# EAGLE design DIGITAL2 (EAGLE 6.5.0)
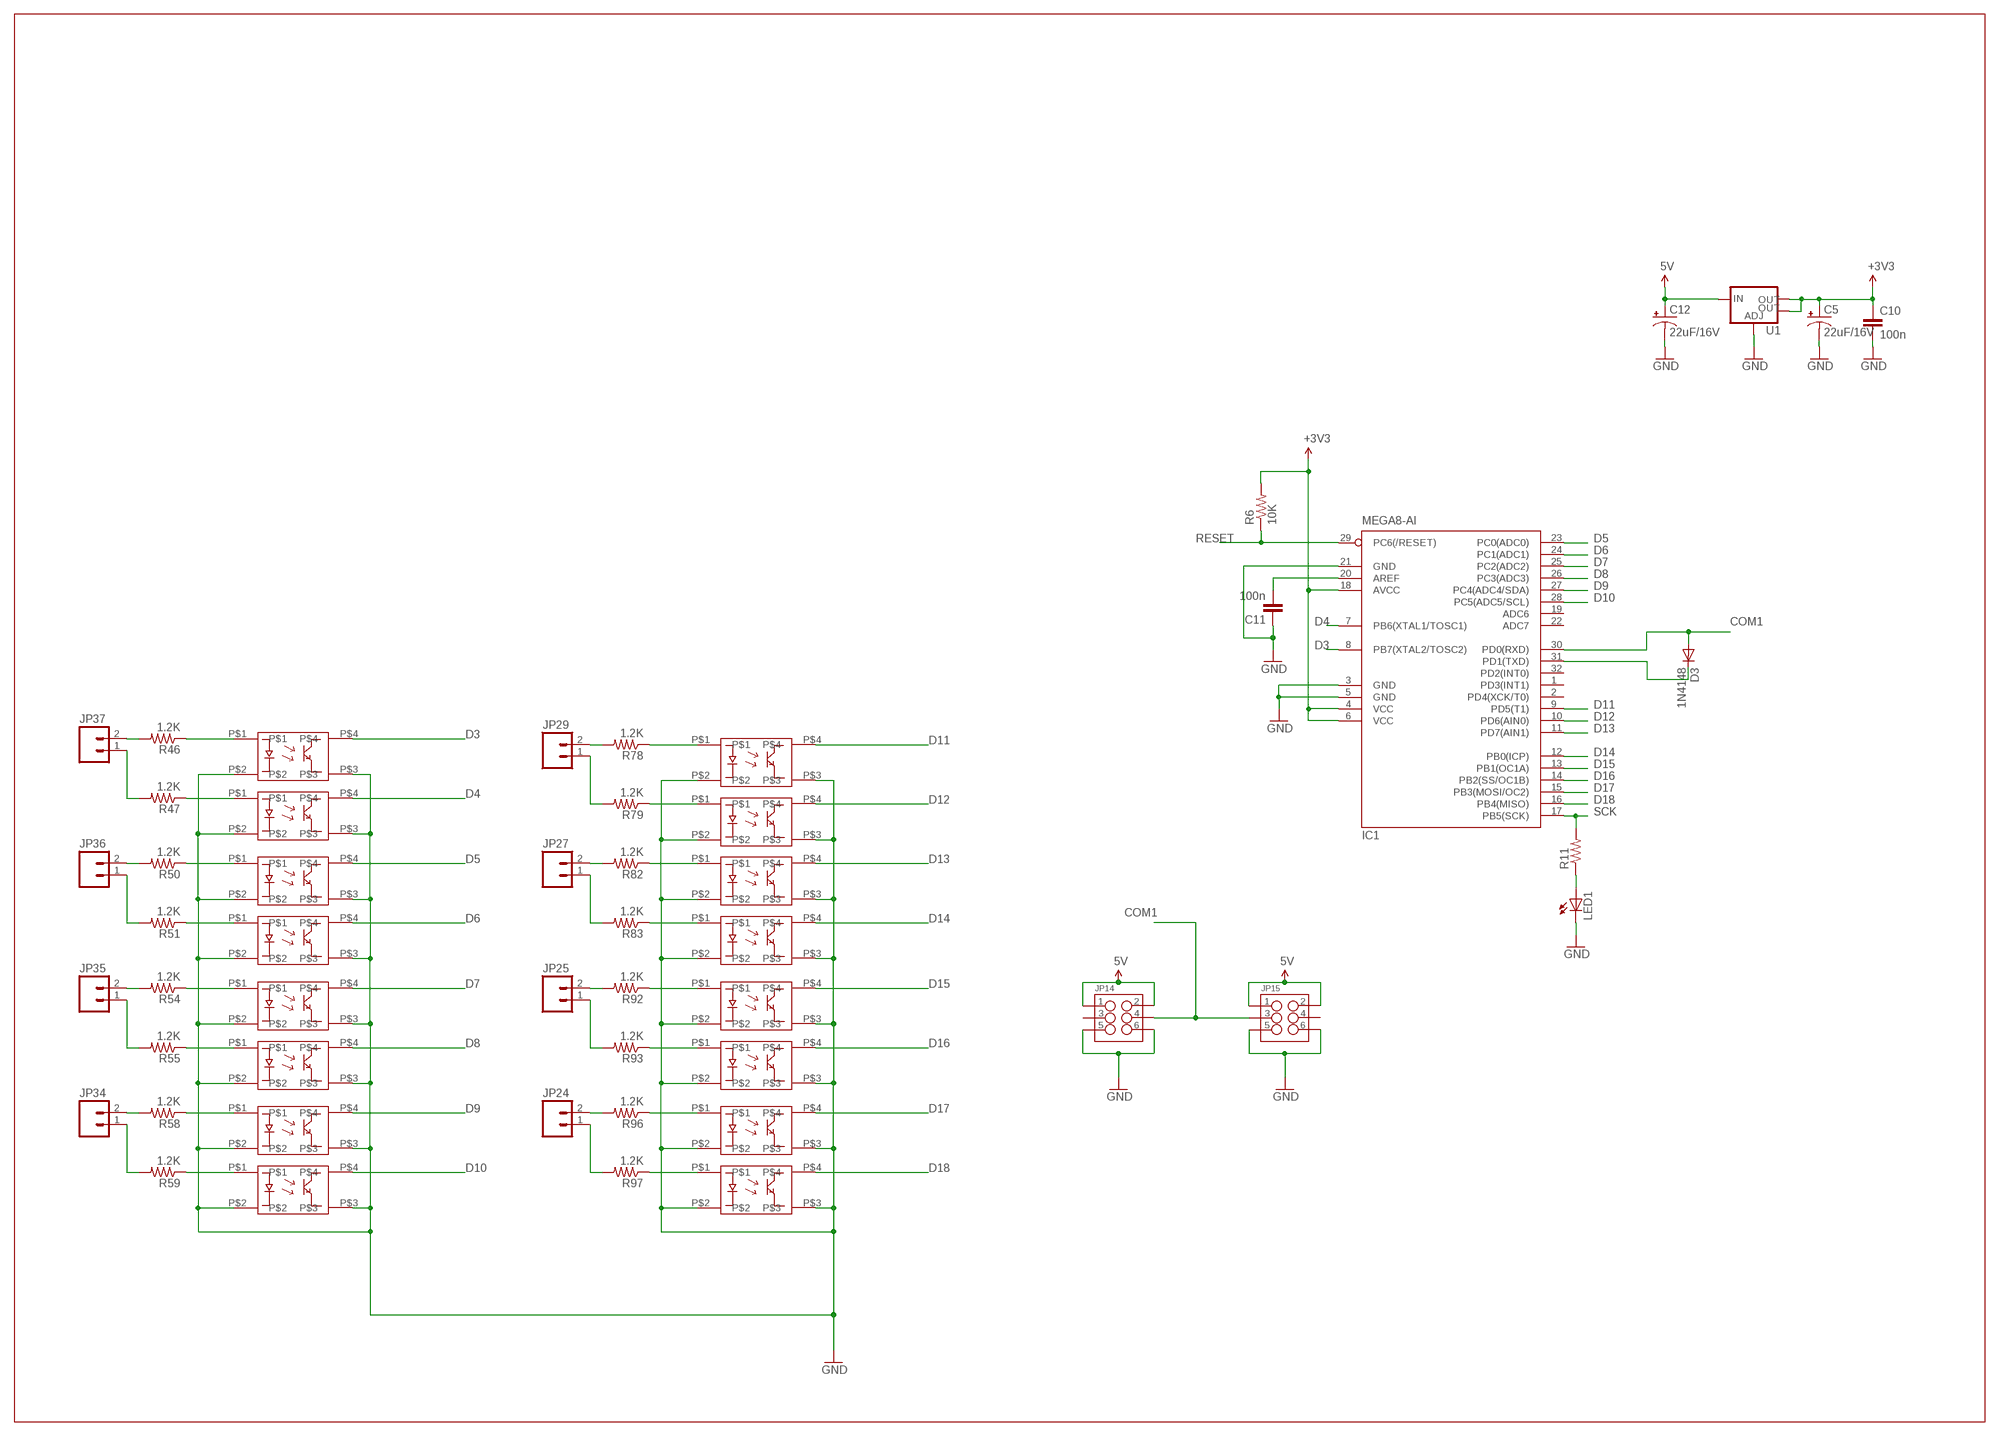
[diagram p0: schematic, sheet 1]

## Parts
C5  22uF/16V  CAP_POL1206  [EIA3216]
C10  100n  CAP0805  [0805]
C11  100n  CAP0805  [0805]
C12  22uF/16V  CAP_POL1206  [EIA3216]
D3  1N4148  DIODE-MINIMELF  [MINIMELF]
IC1  MEGA8-AI  [TQFP32-08]
JP14  M03X22X3_SILK_MALE_PTH  [2X3]
JP15  M03X22X3_SILK_MALE_PTH  [2X3]
JP24  M025MM  [SCREWTERMINAL-5MM-2]
JP25  M025MM  [SCREWTERMINAL-5MM-2]
JP27  M025MM  [SCREWTERMINAL-5MM-2]
JP29  M025MM  [SCREWTERMINAL-5MM-2]
JP34  M025MM  [SCREWTERMINAL-5MM-2]
JP35  M025MM  [SCREWTERMINAL-5MM-2]
JP36  M025MM  [SCREWTERMINAL-5MM-2]
JP37  M025MM  [SCREWTERMINAL-5MM-2]
LED1  LEDCHIP-LED0805  [CHIP-LED0805]
R6  10K  RESISTOR0805-RES  [0805]
R11  RESISTOR0805-RES  [0805]
R46  1.2K  RESISTOR1206  [1206]
R47  1.2K  RESISTOR1206  [1206]
R50  1.2K  RESISTOR1206  [1206]
R51  1.2K  RESISTOR1206  [1206]
R54  1.2K  RESISTOR1206  [1206]
R55  1.2K  RESISTOR1206  [1206]
R58  1.2K  RESISTOR1206  [1206]
R59  1.2K  RESISTOR1206  [1206]
R78  1.2K  RESISTOR1206  [1206]
R79  1.2K  RESISTOR1206  [1206]
R82  1.2K  RESISTOR1206  [1206]
R83  1.2K  RESISTOR1206  [1206]
R92  1.2K  RESISTOR1206  [1206]
R93  1.2K  RESISTOR1206  [1206]
R96  1.2K  RESISTOR1206  [1206]
R97  1.2K  RESISTOR1206  [1206]
U1  V_REG_LM1117SOT223  [SOT223]
U$13  IS181D-I  [TLP181-I]
U$14  IS181D-I  [TLP181-I]
U$15  IS181D-I  [TLP181-I]
U$16  IS181D-I  [TLP181-I]
U$17  IS181D-I  [TLP181-I]
U$18  IS181D-I  [TLP181-I]
U$19  IS181D-I  [TLP181-I]
U$20  IS181D-I  [TLP181-I]
U$29  IS181D-I  [TLP181-I]
U$30  IS181D-I  [TLP181-I]
U$31  IS181D-I  [TLP181-I]
U$32  IS181D-I  [TLP181-I]
U$33  IS181D-I  [TLP181-I]
U$34  IS181D-I  [TLP181-I]
U$35  IS181D-I  [TLP181-I]
U$36  IS181D-I  [TLP181-I]

## Nets
5V: C12.A(+) JP14.1 JP14.2 JP15.1 JP15.2 U1.3(IN)
COM1: D3.A IC1.30(PD0(RXD)) JP14.4 JP15.3
D3: IC1.8(PB7(XTAL2/TOSC2)) U$13.P$4
D4: IC1.7(PB6(XTAL1/TOSC1)) U$14.P$4
D5: IC1.23(PC0(ADC0)) U$15.P$4
D6: IC1.24(PC1(ADC1)) U$16.P$4
D7: IC1.25(PC2(ADC2)) U$17.P$4
D8: IC1.26(PC3(ADC3)) U$18.P$4
D9: IC1.27(PC4(ADC4/SDA)) U$19.P$4
D10: IC1.28(PC5(ADC5/SCL)) U$20.P$4
D11: IC1.9(PD5(T1)) U$29.P$4
D12: IC1.10(PD6(AIN0)) U$30.P$4
D13: IC1.11(PD7(AIN1)) U$31.P$4
D14: IC1.12(PB0(ICP)) U$32.P$4
D15: IC1.13(PB1(OC1A)) U$33.P$4
D16: IC1.14(PB2(SS/OC1B)) U$34.P$4
D17: IC1.15(PB3(MOSI/OC2)) U$35.P$4
D18: IC1.16(PB4(MISO)) U$36.P$4
GND: C5.C(-) C10.2 C11.1 C12.C(-) IC1.3(GND) IC1.5(GND) IC1.21(GND) JP14.5 JP14.6 JP15.5 JP15.6 LED1.C U1.1(ADJ) U$13.P$2 U$13.P$3 U$14.P$2 U$14.P$3 U$15.P$2 U$15.P$3 U$16.P$2 U$16.P$3 U$17.P$2 U$17.P$3 U$18.P$2 U$18.P$3 U$19.P$2 U$19.P$3 U$20.P$2 U$20.P$3 U$29.P$2 U$29.P$3 U$30.P$2 U$30.P$3 U$31.P$2 U$31.P$3 U$32.P$2 U$32.P$3 U$33.P$2 U$33.P$3 U$34.P$2 U$34.P$3 U$35.P$2 U$35.P$3 U$36.P$2 U$36.P$3
N$1: LED1.A R11.1
N$3: D3.C IC1.31(PD1(TXD))
N$4: JP29.2 R78.2
N$5: C11.2 IC1.20(AREF)
N$6: JP27.2 R82.2
N$7: JP25.2 R92.2
N$11: JP24.2 R96.2
N$20: JP27.1 R83.2
N$23: JP25.1 R93.2
N$28: JP24.1 R97.2
N$81: JP37.2 R46.2
N$82: JP37.1 R47.2
N$83: R46.1 U$13.P$1
N$84: R47.1 U$14.P$1
N$87: JP36.2 R50.2
N$88: JP36.1 R51.2
N$89: R50.1 U$15.P$1
N$90: R51.1 U$16.P$1
N$93: JP35.2 R54.2
N$94: JP35.1 R55.2
N$95: R54.1 U$17.P$1
N$96: R55.1 U$18.P$1
N$100: JP34.2 R58.2
N$101: JP34.1 R59.2
N$102: R58.1 U$19.P$1
N$103: R59.1 U$20.P$1
N$138: JP29.1 R79.2
N$139: R78.1 U$29.P$1
N$140: R79.1 U$30.P$1
N$146: R82.1 U$31.P$1
N$147: R83.1 U$32.P$1
N$154: R92.1 U$33.P$1
N$155: R93.1 U$34.P$1
N$160: R96.1 U$35.P$1
N$161: R97.1 U$36.P$1
RESET: IC1.29(PC6(/RESET)) R6.1
SCK: IC1.17(PB5(SCK)) R11.2
VCC: C5.A(+) C10.1 IC1.4(VCC) IC1.6(VCC) IC1.18(AVCC) R6.2 U1.2(OUT) U1.4(OUT) ; supply symbol labelled +3V3
Unconnected: IC1.1(PD3(INT1)) IC1.2(PD4(XCK/T0)) IC1.19(ADC6) IC1.22(ADC7) IC1.32(PD2(INT0)) JP14.3 JP15.4

## Library data of the parts
C5 C12 = SparkFun-Passives:CAP_POL: Capacitor Polarized These are standard SMD and PTH capacitors. Normally 10uF, 47uF, and 100uF in electrolytic and tantalum varieties. Always verify the external diameter of the through hole cap, it varies with capacity, voltage, and manufacturer. The EIA devices should be standard.
C10 C11 = SparkFun-Passives:CAP: Capacitor Standard 0603 ceramic capacitor, and 0.1" leaded capacitor.
D3 = diode:DIODE-: DIODE
IC1 = atmel:MEGA8: MICROCONTROLLER 8 Kbytes FLASH, 1 kbytes SRAM, 512 bytes EEPROM, USART, 6-channel 10 bit ADC, 2-channel 8 bit ADC Pin compatible with Atmega48, ATMega88, ATMega168 Source: avr.lbr; MPN: ATMEGA8-16AU; OC_FARNELL: 9171371; OC_NEWARK: 73M8863
JP14 JP15 = SparkFun-Connectors:M03X2: 2x3 .1" header. Shrouded, with keying- CONN-10681 SMT- CONN-11415 Pogo pins- HW-11044; PROD_ID: CONN-09701
JP24 JP25 JP27 JP29 JP34-JP37 = SparkFun-Connectors:M02: Header 2 Standard 2-pin 0.1" header. Use with straight break away headers (SKU : PRT-00116), right angle break away headers (PRT-00553), swiss pins (PRT-00743), machine pins (PRT-00117), and female headers (PRT-00115). Molex polarized connector foot print use with SKU : PRT-08233 with associated crimp pins and housings.
LED1 = led:LED: LED OSRAM: - CHIPLED LG R971, LG N971, LY N971, LG Q971, LY Q971, LO R971, LY R971 LH N974, LH R974 LS Q976, LO Q976, LY Q976 LO Q996 - Hyper CHIPLED LW Q18S LB Q993, LB Q99A, LB R99A - SideLED LS A670, LO A670, LY A670, LG A670, LP A670 LB A673, LV A673, LT A673, LW A673 LH A674 LY A675 LS A676, LA A676, LO A676, LY A676, LW A676 LS A679, LY A679, LG A679 - Hyper Micro SIDELED® LS Y876, LA Y876, LO Y876, LY Y876 LT Y87S - SmartLED LW L88C, LW L88S LB L89C, LB L89S, LG L890 LS L89K, LO L89K, LY L89K LS L896, LA L896, LO L896, LY L896 - TOPLED LS T670, LO T670, LY T670, LG T670, LP T670 LSG T670, LSP T670, LSY T670, LOP T670, LYG T670 LG T671, LOG T671, LSG T671 LB T673, LV T673, LT T673, LW T673 LH T674 LS T676, LA T676, LO T676, LY T676, LB T676, LH T676, LSB T676, LW T676 LB T67C, LV T67C, LT T67C, LS T67K, LO T67K, LY T67K, LW E67C LS E67B, LA E67B, LO E67B, LY E67B, LB E67C, LV E67C, LT E67C LW T67C LS T679, LY T679, LG T679 LS T770, LO T770, LY T770, LG T770, LP T770 LB T773, LV T773, LT T773, LW T773 LH T774 LS E675, LA E675, LY E675, LS T675 LS T776, LA T776, LO T776, LY T776, LB T776 LHGB T686 LT T68C, LB T68C - Hyper Mini TOPLED® LB M676 - Mini TOPLED Santana® LG M470 LS M47K, LO M47K, LY M47K Source: http://www.osram.convergy.de LUXEON: - LUMILED® LXK2-PW12-R00, LXK2-PW12-S00, LXK2-PW14-U00, LXK2-PW14-V00 LXK2-PM12-R00, LXK2-PM12-S00, LXK2-PM14-U00 LXK2-PE12-Q00, LXK2-PE12-R00, LXK2-PE12-S00, LXK2-PE14-T00, LXK2-PE14-U00 LXK2-PB12-K00, LXK2-PB12-L00, LXK2-PB12-M00, LXK2-PB14-N00, LXK2-PB14-P00, LXK2-PB14-Q00 LXK2-PR12-L00, LXK2-PR12-M00, LXK2-PR14-Q00, LXK2-PR14-R00 LXK2-PD12-Q00, LXK2-PD12-R00, LXK2-PD12-S00 LXK2-PH12-R00, LXK2-PH12-S00 LXK2-PL12-P00, LXK2-PL12-Q00, LXK2-PL12-R00 Source: www.luxeon.com KINGBRIGHT: KA-3528ASYC Source: www.kingbright.com
R6 R11 R46 R47 R50 R51 R54 R55 R58 R59 R78 R79 R82 R83 R92 R93 R96 R97 = SparkFun-Passives:RESISTOR: Resistor Basic schematic elements and footprints for 0603, 1206, and PTH resistors.
U1 = SparkFun-PowerIC:V_REG_LM1117: Voltage Regulator LM1117 Standard adjustable voltage regulator but in SMD form. Spark Fun Electronics SKU : COM-00595; PROD_ID: VREG-08170
U$13-U$20 U$29-U$36 = IS181-I:IS181D-I

## Board
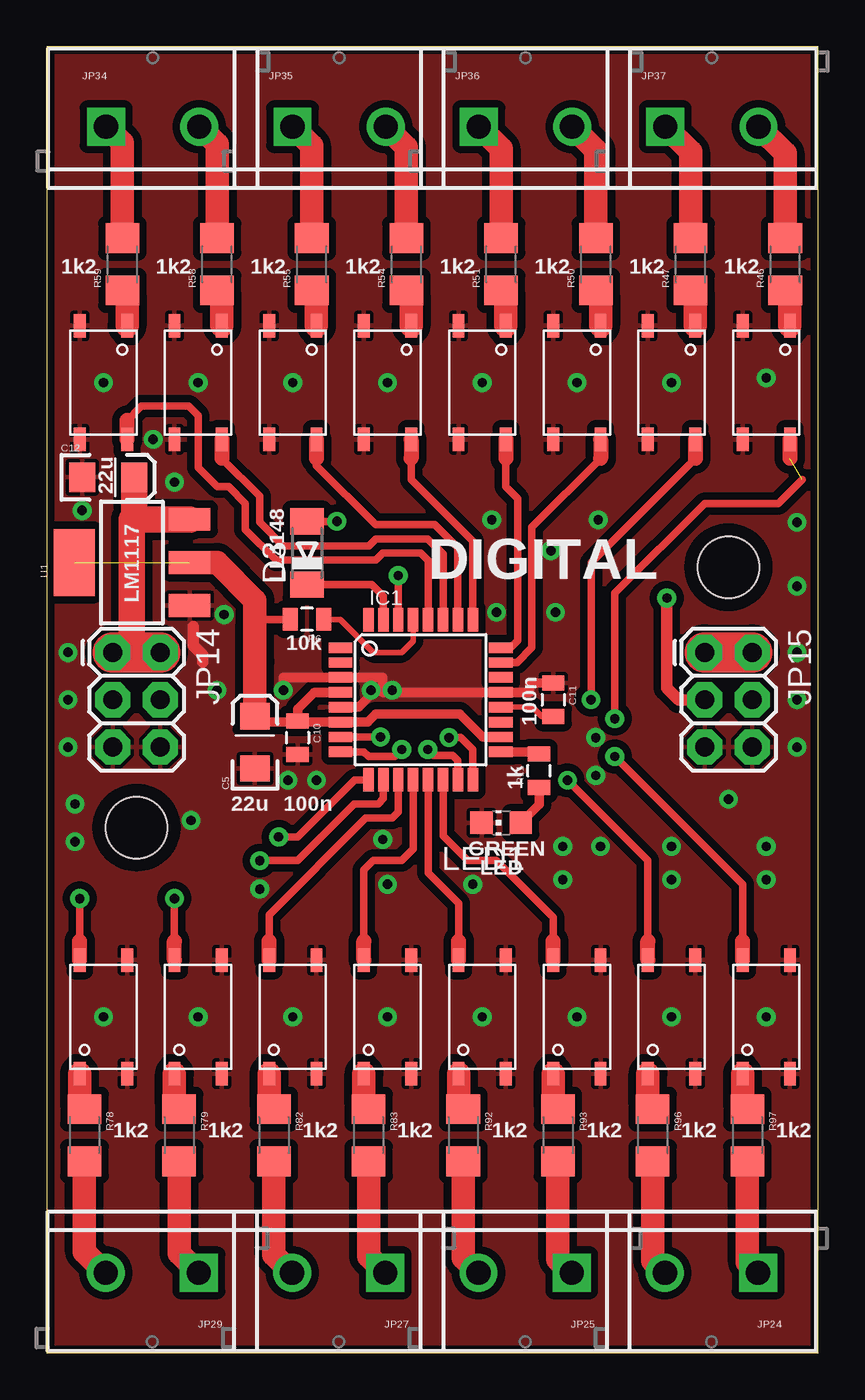
[diagram p1: board, top side]
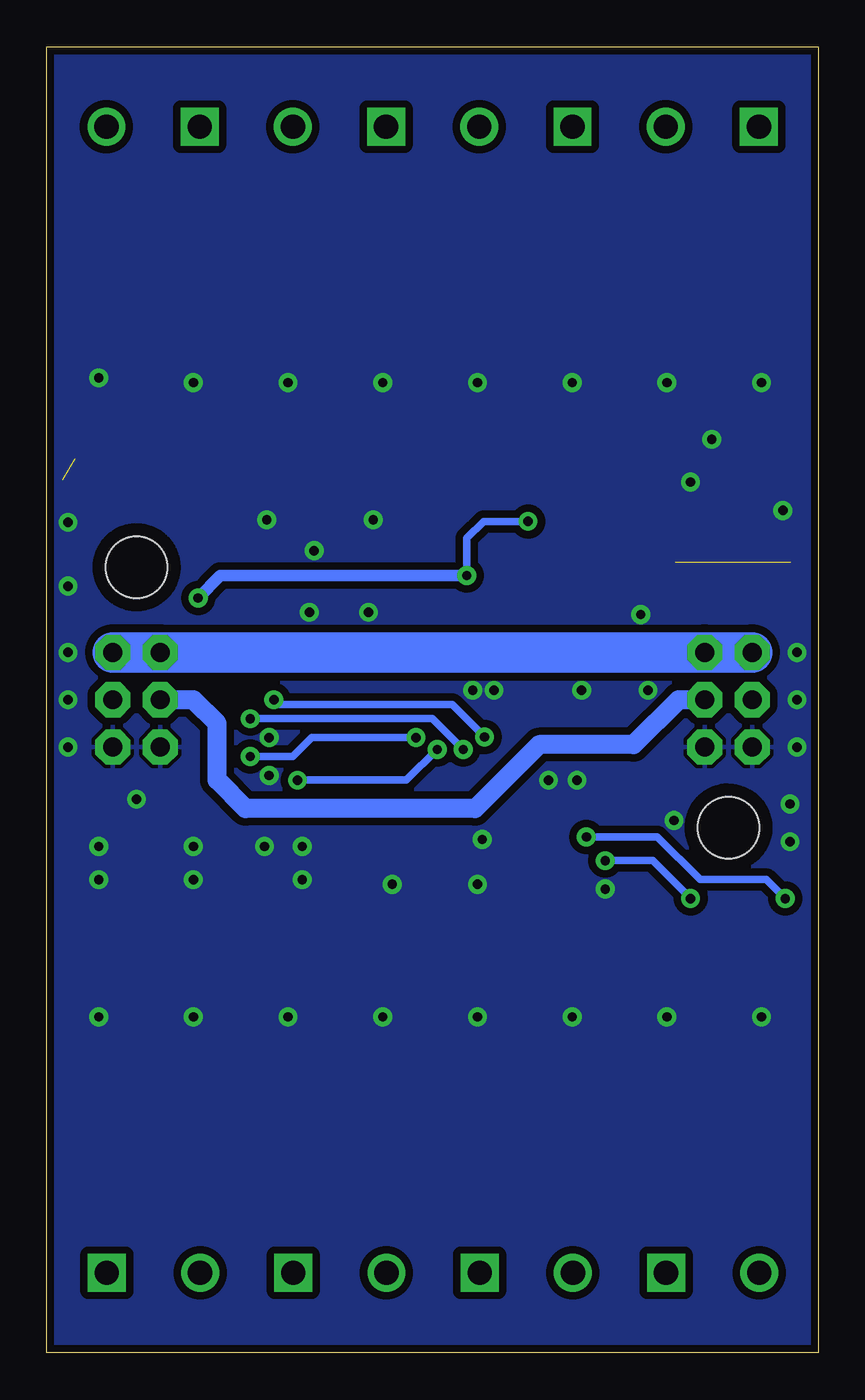
[diagram p2: board, bottom side, seen from below]

Size 41.4 x 70.1 mm. Coordinates in mm from the lower left corner, seen from the top.
Outline: 0,70.1 0,0 41.4,0 41.4,70.1 0,70.1
Copper layers (1*16): Top 0.035mm / dielectric 1.5mm / Bottom 0.035mm
Design rules "default *": minimum track width 8mil, minimum drill 0.4mm, track to track 8mil, track to pad 8mil, pad to pad 8mil, via to via 8mil, smd to smd 8mil, copper to edge 10mil, drill to drill 8mil, minimum pad ring 8mil, minimum via ring 10mil, stop-mask expansion 3mil, vias tented up to drill 0mil, thermal gap 8mil

### Footprints (pad centres in the part's own frame; a part is rotated, then mirrored left to right if it is on the bottom)
EIA3216 = smd 1.4 x 1.6: A 1.4,0; C -1.4,0
0805 = smd 0.8 x 1.2: 1 -0.9,0; 2 0.9,0
MINIMELF = smd 1.4 x 1.8: A 1.7,0; C -1.7,0
TQFP32-08 = smd 1.27 x 0.559: 1 -4.293,2.8; 2 -4.293,2; 3 -4.293,1.2; 4 -4.293,0.4; 5 -4.293,-0.4; 6 -4.293,-1.2; 7 -4.293,-2; 8 -4.293,-2.8; 17 4.293,-2.8; 18 4.293,-2; 19 4.293,-1.2; 20 4.293,-0.4; 21 4.293,0.4; 22 4.293,1.2; 23 4.293,2; 24 4.293,2.8 | smd 0.559 x 1.27: 9 -2.8,-4.293; 10 -2,-4.293; 11 -1.2,-4.293; 12 -0.4,-4.293; 13 0.4,-4.293; 14 1.2,-4.293; 15 2,-4.293; 16 2.8,-4.293; 25 2.8,4.293; 26 2,4.293; 27 1.2,4.293; 28 0.4,4.293; 29 -0.4,4.293; 30 -1.2,4.293; 31 -2,4.293; 32 -2.8,4.293
2X3 = drill 1.016 pad 1.88 octagon: 1 0,0; 2 0,2.54; 3 2.54,0; 4 2.54,2.54; 5 5.08,0; 6 5.08,2.54
SCREWTERMINAL-5MM-2 = drill 1.3 pad 2.032 square: 1 0,0 | drill 1.3 pad 2.032: 2 5,0
CHIP-LED0805 = smd 1.2 x 1.2: A 0,-1.05; C 0,1.05
1206 = smd 1.6 x 1.8: 1 -1.4,0; 2 1.4,0
STAND-OFF = hole 3.302: 0,0
SOT223 = smd 1.219 x 2.235: 1 -2.311,-3.099; 2 0,-3.099; 3 2.311,-3.099 | smd 3.6 x 2.2: 4 0,3.099
TLP181-I = smd 1.27 x 0.635: P$1 -3.048,1.27; P$2 -3.048,-1.27; P$3 3.048,-1.27; P$4 3.048,1.27

### Placement (x,y rotation side)
C5  11.18,32.77 90 top
C10  13.46,33.02 270 top
C11  27.18,35.05 270 top
C12  3.3,46.99 0 top
D3  13.97,42.93 90 top
IC1  20.07,35.05 0 top
JP14  3.56,37.59 270 top
JP15  35.31,37.59 270 top
JP24  38.17,4.3 180 top
JP25  28.17,4.3 180 top
JP27  18.17,4.3 180 top
JP29  8.17,4.3 180 top
JP34  3.19,65.81 0 top
JP35  13.19,65.81 0 top
JP36  23.19,65.81 0 top
JP37  33.19,65.81 0 top
LED1  24.38,28.45 90 top
R6  13.97,39.37 180 top
R11  26.42,31.24 90 top
R46  39.62,58.42 90 top
R47  34.54,58.42 90 top
R50  29.46,58.42 90 top
R51  24.38,58.42 90 top
R54  19.3,58.42 90 top
R55  14.22,58.42 90 top
R58  9.14,58.42 90 top
R59  4.06,58.42 90 top
R78  2.03,11.68 270 top
R79  7.11,11.68 270 top
R82  12.19,11.68 270 top
R83  17.27,11.68 270 top
R92  22.35,11.68 270 top
R93  27.43,11.68 270 top
R96  32.51,11.68 270 top
R97  37.59,11.68 270 top
STANDOFF1  STAND-OFF  [STAND-OFF]  4.83,28.19 180 top
STANDOFF3  STAND-OFF  [STAND-OFF]  36.58,42.16 180 top
U1  4.57,42.42 90 top
U$13  38.61,52.07 270 top
U$14  33.53,52.07 270 top
U$15  28.45,52.07 270 top
U$16  23.37,52.07 270 top
U$17  18.29,52.07 270 top
U$18  13.21,52.07 270 top
U$19  8.13,52.07 270 top
U$20  3.05,52.07 270 top
U$29  3.05,18.03 90 top
U$30  8.13,18.03 90 top
U$31  13.21,18.03 90 top
U$32  18.29,18.03 90 top
U$33  23.37,18.03 90 top
U$34  28.45,18.03 90 top
U$35  33.53,18.03 90 top
U$36  38.61,18.03 90 top

### Tracks (layer width: path | path; a pad name or v marks a point on that pad's centre or on a via)
5V
  Top 1.422: 4.57,37.59 4.57,44.73 4.7,44.73 | U1.3 4.7,44.73 | 4.7,44.73 C12.A
  Top 2.184: JP14.2 4.57,37.59 JP14.1 | JP15.1 JP15.2
  Bottom 2.184: JP14.2 JP14.1 JP15.1 JP15.2
COM1  (via drill 0.5)
  Top 0.406: v18.87,41.71 IC1.30 | D3.A v15.57,44.63
  Top 0.61: v33.27,40.51 33.27,35.69 33.91,35.05 JP15.3
  Bottom 0.406: v15.57,44.63 17.96,44.63 18.87,43.72 v18.87,41.71
  Bottom 0.61: v33.27,40.51 32.07,41.71 v18.87,41.71
  Bottom 1.016: JP15.3 33.53,35.05 32.26,33.78 32.26,30.73 30.73,29.21 18.41,29.21 14.99,32.64 9.91,32.64 7.49,35.05 JP14.4
D3  (via drill 0.5)  (1 unrouted)
  Top 0.406: IC1.8 17.02,32.25 17.27,32 18.67,32 v19.05,32.38 | v30.48,34.04 30.48,40.77 35.31,45.59 39.24,45.59 40.52,46.87
  Top 0.813: U$13.P$4 39.88,48.01
  Bottom 0.406: v30.48,34.04 20.7,34.04 v19.05,32.38
D4  (via drill 0.5)
  Top 0.406: IC1.7 v17.91,33.05 | v29.21,35.05 29.21,40.64 29.21,40.76 29.21,42.42 34.8,48.01
  Top 0.813: U$14.P$4 34.8,48.01
  Bottom 0.406: v29.21,35.05 28.96,34.8 19.65,34.8 v17.91,33.05
D5
  Top 0.406: IC1.23 25.24,37.05 26.04,37.85 26.04,44.32 29.72,48.01
  Top 0.813: U$15.P$4 29.72,48.01
D6
  Top 0.406: IC1.24 24.9,37.85 25.28,38.24 25.28,45.84 24.64,46.48 24.64,48.01
  Top 0.813: U$16.P$4 24.64,48.01
D7
  Top 0.406: IC1.25 22.87,43.55 19.56,46.86 19.56,48.01
  Top 0.813: U$17.P$4 19.56,48.01
D8
  Top 0.406: IC1.26 22.07,43.21 20.83,44.45 17.65,44.45 14.48,47.62 14.48,48.26
  Top 0.813: U$18.P$4 14.48,48.26 14.48,48.01
D9
  Top 0.406: IC1.27 21.27,42.87 20.45,43.69 17.65,43.69 17.27,43.31 12.7,43.31 11.43,44.58 11.43,45.97 9.4,48.01
  Top 0.813: U$19.P$4 9.4,48.01
D10
  Top 0.406: IC1.28 20.47,42.53 20.07,42.93 18.03,42.93 17.65,42.55 12.32,42.55 10.67,44.2 10.67,45.59 9.78,46.48 9.14,46.48 8.13,47.5 8.13,50.29 7.62,50.8 5.08,50.8 4.32,50.04
  Top 0.813: U$20.P$4 4.32,50.04
D11  (via drill 0.5)
  Top 0.406: IC1.9 16.54,30.76 13.46,27.69 v12.45,27.69 | v1.78,24.38 1.78,22.1
  Top 0.813: U$29.P$4 1.78,22.1
  Bottom 0.406: v1.78,24.38 2.79,25.4 6.35,25.4 8.64,27.69 v12.45,27.69
D12  (via drill 0.5)
  Top 0.406: IC1.10 18.07,29.75 17.78,29.46 16.51,29.46 13.46,26.42 v11.43,26.42 | v6.86,24.38 6.86,22.1
  Top 0.813: U$30.P$4 6.86,22.1
  Bottom 0.406: v6.86,24.38 8.89,26.42 v11.43,26.42
D13
  Top 0.406: IC1.11 18.87,29.03 18.54,28.7 17.13,28.7 11.94,23.51 11.94,22.1
  Top 0.813: U$31.P$4 11.94,22.1
D14
  Top 0.406: IC1.12 19.67,27.03 19.05,26.42 17.53,26.42 17.02,25.91 17.02,22.1
  Top 0.813: U$32.P$4 17.02,22.1
D15
  Top 0.406: IC1.13 20.47,25.76 22.1,24.13 22.1,21.84
  Top 0.813: U$33.P$4 22.1,21.84 22.1,22.1
D16
  Top 0.406: IC1.14 21.27,27.76 22.61,26.42 24.13,26.42 27.18,23.37 27.18,22.1
  Top 0.813: U$34.P$4 27.18,22.1
D17  (via drill 0.5)
  Top 0.406: IC1.15 22.07,31.78 21.78,32.07 20.77,32.07 v20.45,32.38 | v27.94,30.73 32.26,26.42 32.26,22.1
  Top 0.813: U$35.P$4 32.26,22.1
  Bottom 0.406: v27.94,30.73 22.1,30.73 v20.45,32.38
D18  (via drill 0.5)
  Top 0.406: IC1.16 22.87,32.38 22.23,33.02 v21.59,33.02 | v30.48,32 37.34,25.15 37.34,21.84
  Top 0.813: U$36.P$4 37.34,21.84 37.34,22.1
  Bottom 0.406: v21.59,33.02 27.18,33.02 28.19,32 v30.48,32
GND  (via drill 0.5)
  Top 0.508: v12.7,35.56 12.7,36.25 IC1.3 18.03,36.25 18.03,35.45 IC1.21 25.91,35.45 25.91,35.95 C11.1 | IC1.5 16.75,34.65 17.4,35.31 v17.4,35.56
  Top 0.61: 8.38,37.08 8.38,37.47 7.87,37.97 7.87,38.99
  other vias: 3.05,18.03 23.37,52.07 3.05,52.07 38.61,52.32 8.13,52.07 33.53,52.07 13.21,52.07 28.45,52.07 18.29,52.07 8.13,18.03 13.21,18.03 18.29,18.03 38.61,18.03 33.53,18.03 28.45,18.03 23.37,18.03 9.53,39.62 5.71,49.02 6.86,46.74 18.54,35.56 36.58,29.72 23.88,44.7 29.59,44.7 40.26,44.58 1.91,45.21 1.14,37.59 1.14,35.05 1.14,32.51 40.26,37.59 40.26,35.05 40.26,32.51 1.52,29.46 11.43,24.89 18.29,25.15 22.86,25.15 27.69,25.4 33.53,25.4 38.61,25.4 40.26,41.15 29.46,33.02 7.75,28.57 1.52,27.43 18.03,27.56 27.69,27.18 33.53,27.18 38.61,27.18 29.46,30.99 27.3,39.75 24.13,39.75 12.95,30.73 14.48,30.73 27.05,43.05 9.14,35.56 29.72,27.18
  pour Top (isolate 0.406): 0,70.1 41.4,70.1 41.4,0 0,0
  pour Bottom (isolate 0.406): 0,70.1 41.4,70.1 41.4,0 0,0
N$1
  Top 0.508: LED1.A 26.42,29.43 R11.1
N$3
  Top 0.406: IC1.31 18.07,40.61 17.45,41.23 D3.C
N$4
  Top 1.27: JP29.2 2.03,5.43 R78.2
N$5
  Top 0.305: IC1.20 26.05,34.65 26.55,34.15 C11.2
N$6
  Top 1.27: JP27.2 12.19,5.27 R82.2
N$7
  Top 1.27: JP25.2 22.35,5.11 R92.2
N$11
  Top 1.27: JP24.2 32.51,4.95 R96.2
N$20
  Top 1.27: JP27.1 17.27,5.19 R83.2
N$23
  Top 1.27: JP25.1 27.43,5.03 R93.2
N$28
  Top 1.27: JP24.1 37.59,4.87 R97.2
N$81
  Top 1.27: JP37.2 39.62,64.37 R46.2
N$82
  Top 1.27: JP37.1 34.54,64.45 R47.2
N$83
  Top 1.27: R46.1 39.88,56.77 U$13.P$1
N$84
  Top 1.27: R47.1 34.8,56.77 U$14.P$1
N$87
  Top 1.27: JP36.2 29.46,64.53 R50.2
N$88
  Top 1.27: JP36.1 24.38,64.61 R51.2
N$89
  Top 1.27: R50.1 29.72,56.77 U$15.P$1
N$90
  Top 1.27: R51.1 24.64,56.77 U$16.P$1
N$93
  Top 1.27: JP35.2 19.3,64.69 R54.2
N$94
  Top 1.27: JP35.1 14.22,64.77 R55.2
N$95
  Top 1.27: R54.1 19.56,56.77 U$17.P$1
N$96
  Top 1.27: R55.1 14.48,56.77 U$18.P$1
N$100
  Top 1.27: JP34.2 9.14,64.85 R58.2
N$101
  Top 1.27: JP34.1 4.06,64.93 R59.2
N$102
  Top 1.27: R58.1 9.4,56.77 U$19.P$1
N$103
  Top 1.27: R59.1 4.32,56.77 U$20.P$1
N$138
  Top 1.27: JP29.1 7.11,5.35 R79.2
N$139
  Top 1.27: R78.1 1.78,13.34 U$29.P$1
N$140
  Top 1.27: R79.1 6.86,13.34 U$30.P$1
N$146
  Top 1.27: R82.1 11.94,13.34 U$31.P$1
N$147
  Top 1.27: R83.1 17.02,13.34 U$32.P$1
N$154
  Top 1.27: R92.1 22.1,13.34 U$33.P$1
N$155
  Top 1.27: R93.1 27.18,13.34 U$34.P$1
N$160
  Top 1.27: R96.1 32.26,13.34 U$35.P$1
N$161
  Top 1.27: R97.1 37.34,13.34 U$36.P$1
RESET
  Top 0.305: R6.1 15.75,39.37 17.53,37.59 19.05,37.59 19.67,38.21 IC1.29
SCK
  Top 0.508: IC1.17 26.31,32.25 R11.2
VCC  (1 unrouted)
  Top 0.406: 11.18,39.12 11.18,39.37 R6.2
  Top 0.508: C5.A 11.18,33.85 13.46,33.85 | IC1.4 14.37,35.45 13.46,34.54 C10.1 13.46,33.85 | 13.46,33.85 IC1.6 17.21,33.85 17.65,34.29 22.16,34.29 23.4,33.05 IC1.18
  Top 0.61: 11.09,37 11.18,37.08
  Top 1.27: C5.A 11.18,37.08 11.18,39.12 | U1.2 9.14,42.42 11.18,40.39 11.18,39.37

### Text on the board
tPlace: 1k2 | 1k2 | 1k2 | 1k2 | 1k2 | 1k2 | 1k2 | 1k2 | 22u | LL4148 | DIGITAL | LM1117 | 10k | 100n | 1k | 22u | 100n | GREEN | LED | 1k2 | 1k2 | 1k2 | 1k2 | 1k2 | 1k2 | 1k2 | 1k2